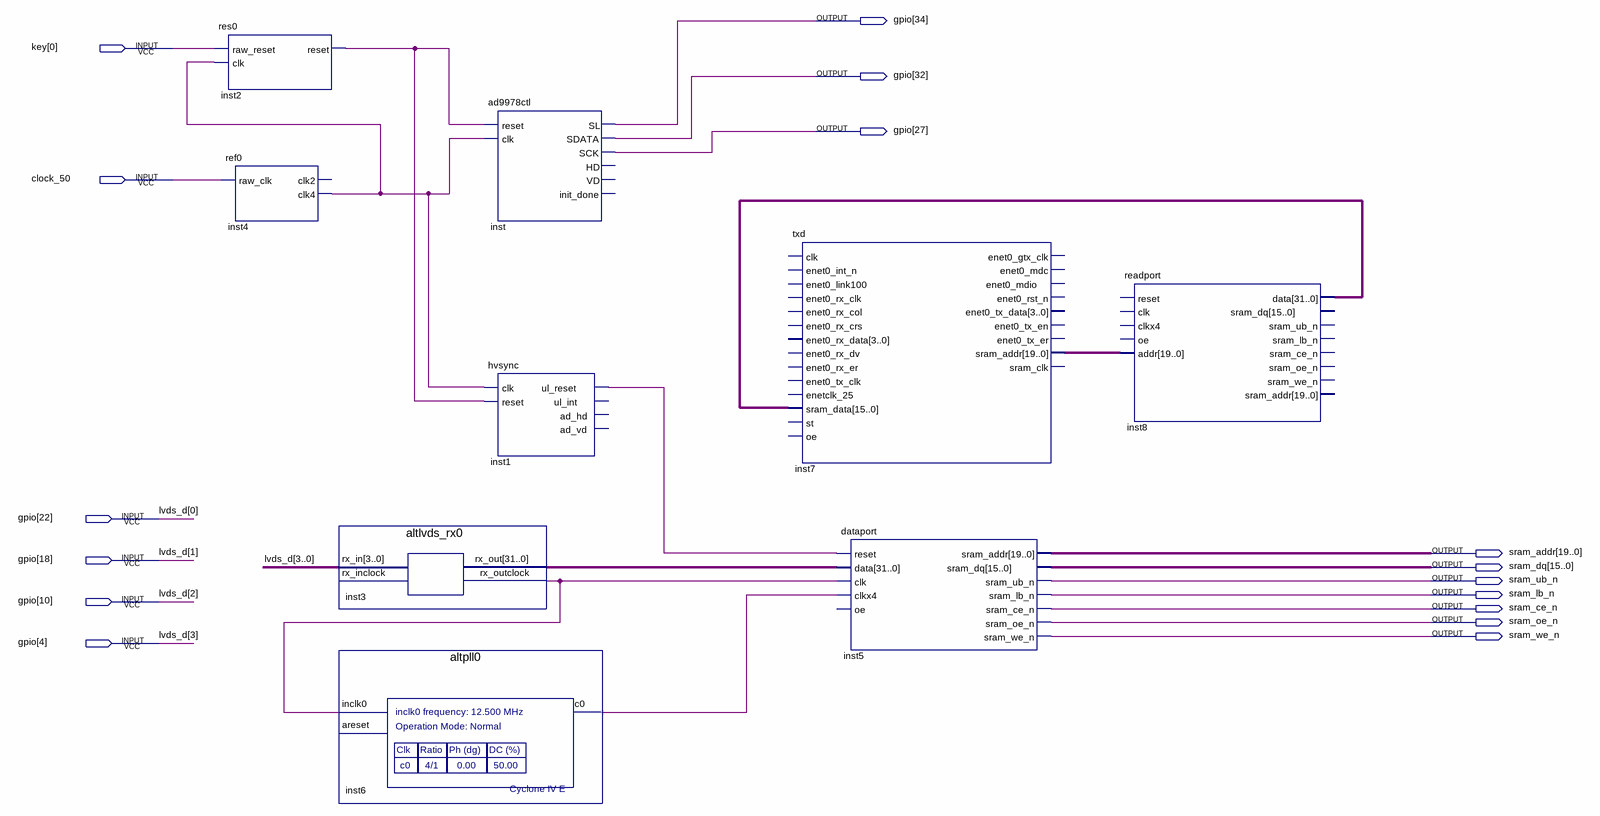
[diagram p0: schematic sheet]
// Quartus schematic paralax.bdf as structural Verilog: 9 symbols, 16 pins
module paralax (
  input  [0:0] key,
  input  clock_50,
  inout  [34:4] gpio,
  output [19:0] sram_addr,
  output [15:0] sram_dq,
  output sram_ub_n,
  output sram_lb_n,
  output sram_ce_n,
  output sram_oe_n,
  output sram_we_n
);

  wire inst1_ul_reset, inst2_reset, inst3_rx_outclock, inst4_clk4, inst6_c0;
  wire [19:0] inst7_sram_addr;
  wire [31:0] inst3_rx_out, inst8_data;

  res0 inst2 (.raw_reset(key[0]), .clk(inst4_clk4), .reset(inst2_reset));
  ref0 inst4 (.raw_clk(clock_50), .clk4(inst4_clk4));  // open: clk2
  altlvds_rx0 inst3 (
    .rx_in({gpio[4], gpio[10], gpio[18], gpio[22]}), .rx_out(inst3_rx_out), .rx_outclock(inst3_rx_outclock));  // open: rx_inclock
  altpll0 inst6 (.inclk0(inst3_rx_outclock), .c0(inst6_c0));  // open: areset
  ad9978ctl inst (
    .reset(inst2_reset), .clk(inst4_clk4), .SL(gpio[34]), .SDATA(gpio[32]), .SCK(gpio[27]));  // open: HD, VD, init_done
  hvsync inst1 (.clk(inst4_clk4), .reset(inst2_reset), .ul_reset(inst1_ul_reset));  // open: ul_int, ad_hd, ad_vd
  txd inst7 (
    .sram_data(inst8_data), .sram_addr(inst7_sram_addr));  // open: clk, enet0_int_n, enet0_link100, enet0_rx_clk, enet0_rx_col, enet0_rx_crs, enet0_rx_data, enet0_rx_dv, enet0_rx_er, enet0_tx_clk, enetclk_25, st, oe, enet0_gtx_clk, enet0_mdc, enet0_rst_n, enet0_tx_data, enet0_tx_en, enet0_tx_er, sram_clk, enet0_mdio
  dataport inst5 (
    .reset(inst1_ul_reset), .data(inst3_rx_out), .clk(inst3_rx_outclock), .clkx4(inst6_c0),
    .sram_addr(sram_addr), .sram_ub_n(sram_ub_n), .sram_lb_n(sram_lb_n), .sram_ce_n(sram_ce_n),
    .sram_oe_n(sram_oe_n), .sram_we_n(sram_we_n), .sram_dq(sram_dq));  // open: oe
  readport inst8 (
    .addr(inst7_sram_addr), .data(inst8_data));  // open: reset, clk, clkx4, oe, sram_ub_n, sram_lb_n, sram_ce_n, sram_oe_n, sram_we_n, sram_addr, sram_dq

  // Other names for the same wires on the sheet: lvds_d[3:0] = {gpio[4], gpio[10], gpio[18], gpio[22]}
endmodule
